# EAGLE design mosfet_shield (EAGLE 7.7.0)
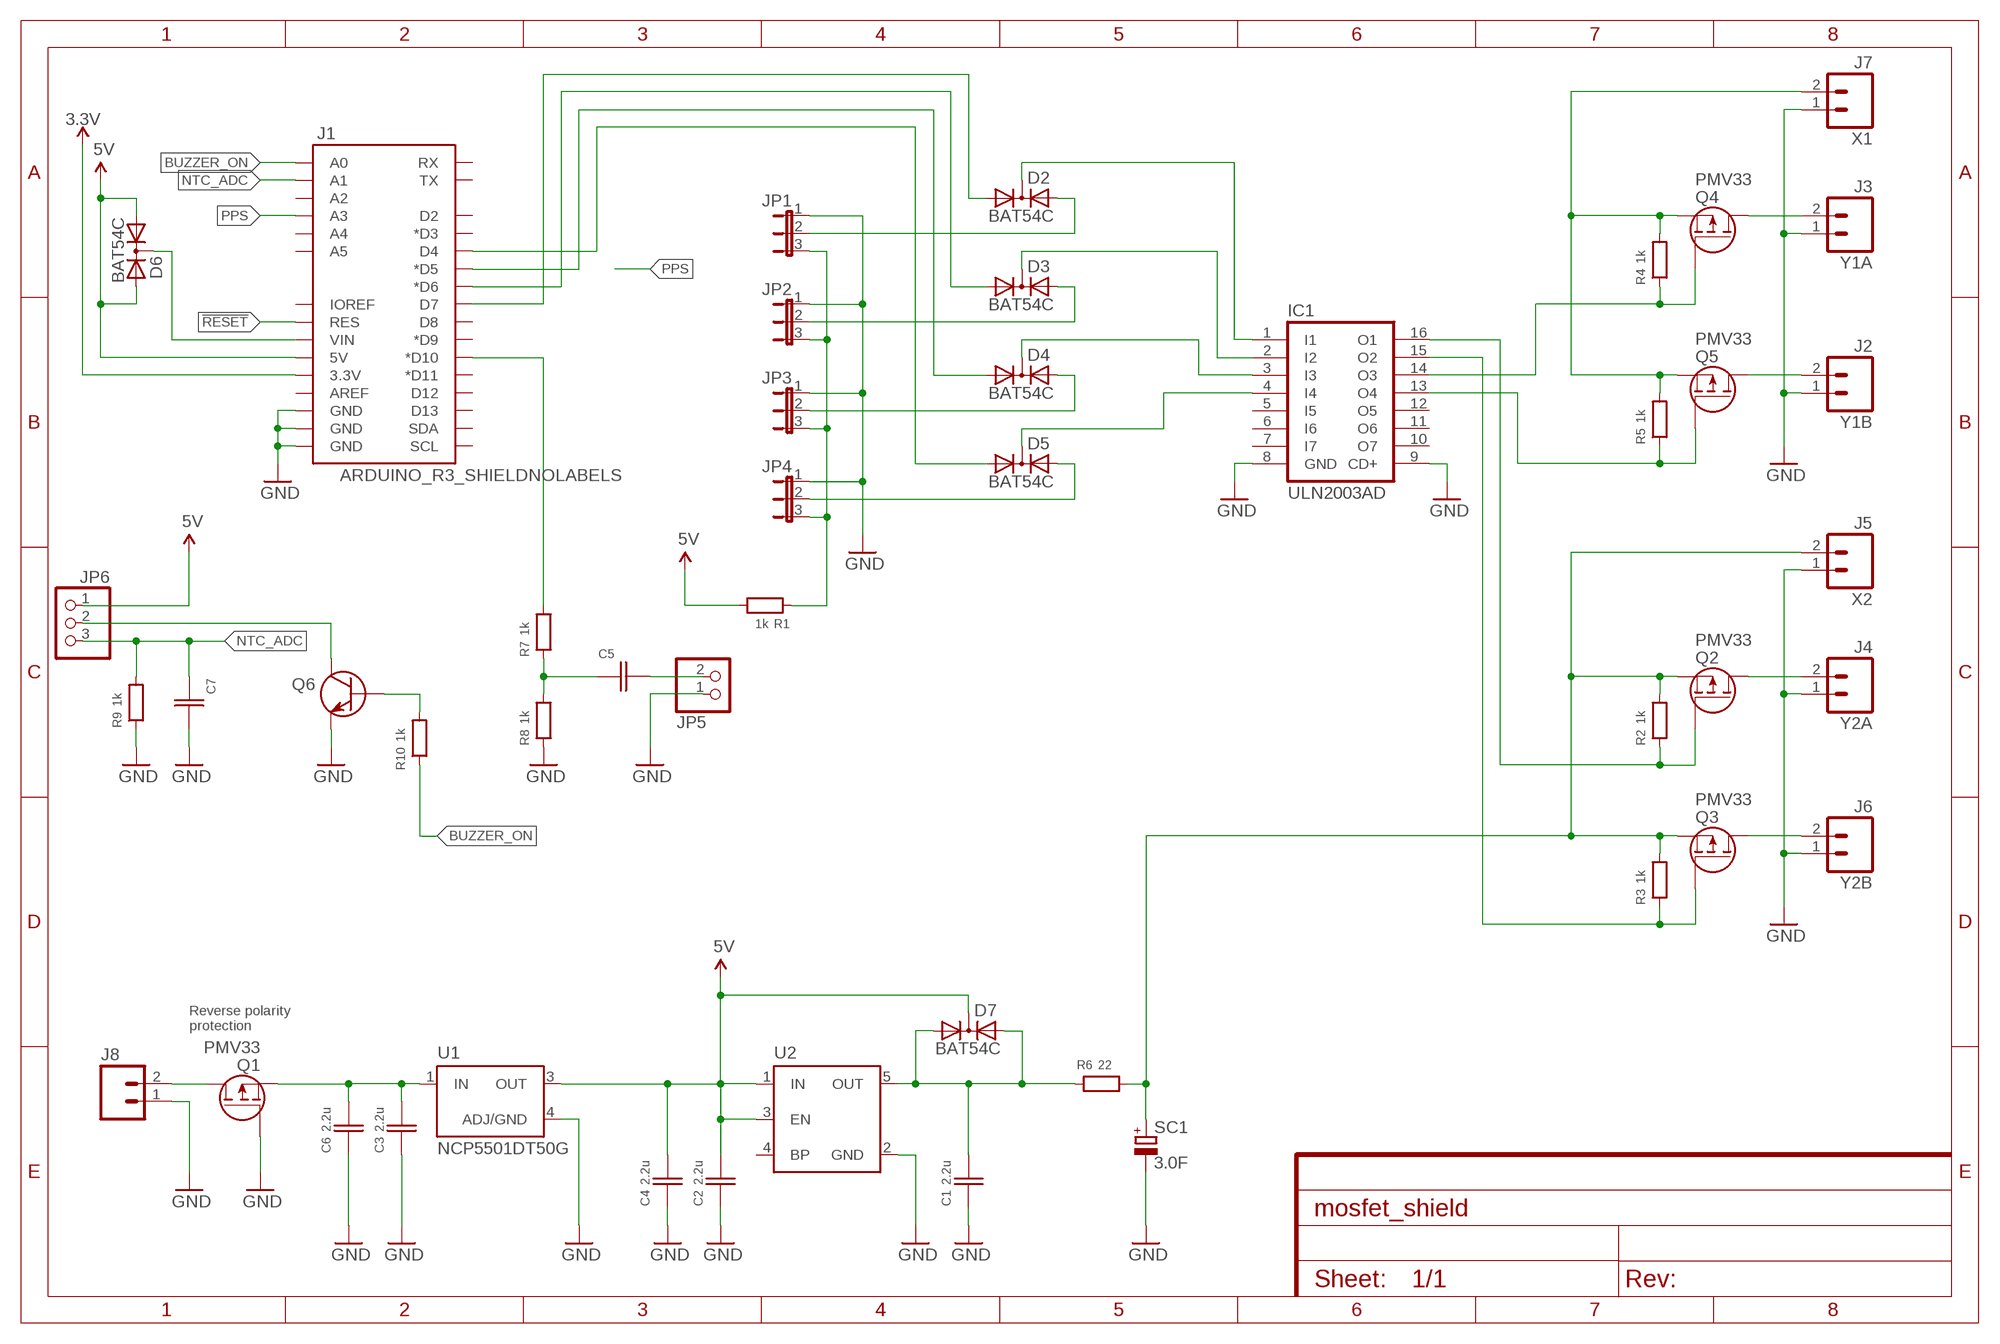
[diagram p0: schematic, sheet 1]

## Parts
C1  2.2u  CAPACITOR_NPOL-1206  [C1206]
C2  2.2u  CAPACITOR_NPOL-1206  [C1206]
C3  2.2u  CAPACITOR_NPOL-1206  [C1206]
C4  2.2u  CAPACITOR_NPOL-1206  [C1206]
C5  CAPACITOR_NPOL-0603  [C603]
C6  2.2u  CAPACITOR_NPOL-1206  [C1206]
C7  CAPACITOR_NPOL-0603  [C603]
D2  BAT54C  DIODE-2AC|CASOT23  [SOT23]
D3  BAT54C  DIODE-2AC|CASOT23  [SOT23]
D4  BAT54C  DIODE-2AC|CASOT23  [SOT23]
D5  BAT54C  DIODE-2AC|CASOT23  [SOT23]
D6  BAT54C  DIODE-2AC|CASOT23  [SOT23]
D7  BAT54C  DIODE-2AC|CASOT23  [SOT23]
IC1  ULN2003AD  [SO16]
J1  ARDUINO_R3_SHIELDNOLABELS  [UNO_R3_SHIELD_NOLABELS]
J2  Y1B  M023.5MM  [SCREWTERMINAL-3.5MM-2]
J3  Y1A  M023.5MM  [SCREWTERMINAL-3.5MM-2]
J4  Y2A  M023.5MM  [SCREWTERMINAL-3.5MM-2]
J5  X2  M023.5MM  [SCREWTERMINAL-3.5MM-2]
J6  Y2B  M023.5MM  [SCREWTERMINAL-3.5MM-2]
J7  X1  M023.5MM  [SCREWTERMINAL-3.5MM-2]
J8  M023.5MM  [SCREWTERMINAL-3.5MM-2]
JP1  JP2E  [JP2]
JP2  JP2E  [JP2]
JP3  JP2E  [JP2]
JP4  JP2E  [JP2]
JP5  PINHD-1X2  [1X02]
JP6  PINHD-1X3  [1X03]
Q1  PMV33  MOSFET-P-SOT23-3  [SOT23-3]
Q2  PMV33  MOSFET-P-SOT23-3  [SOT23-3]
Q3  PMV33  MOSFET-P-SOT23-3  [SOT23-3]
Q4  PMV33  MOSFET-P-SOT23-3  [SOT23-3]
Q5  PMV33  MOSFET-P-SOT23-3  [SOT23-3]
Q6  BJT-NPN-SOT23-3  [SOT23-3]
R1  1k  RESISTOR-0603  [R0603]
R2  1k  RESISTOR-0603  [R0603]
R3  1k  RESISTOR-0603  [R0603]
R4  1k  RESISTOR-0603  [R0603]
R5  1k  RESISTOR-0603  [R0603]
R6  22  RESISTOR-0603  [R0603]
R7  1k  RESISTOR-0603  [R0603]
R8  1k  RESISTOR-0603  [R0603]
R9  1k  RESISTOR-0603  [R0603]
R10  1k  RESISTOR-0603  [R0603]
SC1  3.0F  CPOL-EUE3.5-8  [E3,5-8]
U1  NCP5501DT50G  VREG-3PIN-DPAK  [DPAK]
U2  VREG-5PIN-SOT23  [SOT23-5]

## Nets
3.3V: J1.3.3V
5V: C2.2 C4.2 D6.1(A1) D6.2(A2) D7.3(C) J1.5V JP6.1 R1.2 U1.3(OUT) U2.1(IN) U2.3(EN)
!RESET: J1.RES
BUZZER_ON: J1.A0 R10.1
GND: C1.1 C2.1 C3.1 C4.1 C6.1 C7.2 IC1.8(GND) IC1.9(CD+) J1.GND@0(GND) J1.GND@1(GND) J1.GND@2(GND) J2.1 J3.1 J4.1 J5.1 J6.1 J7.1 J8.1 JP1.1 JP2.1 JP3.1 JP4.1 JP5.1 Q1.1(G) Q6.2(E) R8.1 R9.1 SC1.- U1.4(ADJ/GND) U2.2(GND)
N$1: D2.2(A2) JP1.2
N$2: D3.2(A2) JP2.2
N$3: J3.2 Q4.3(D)
N$4: C3.2 C6.2 Q1.2(S) U1.1(IN)
N$5: IC1.15(O2) Q3.1(G) R3.1
N$6: IC1.16(O1) Q2.1(G) R2.1
N$7: J7.2 Q4.2(S) Q5.2(S) R4.2 R5.2
N$8: J2.2 Q5.3(D)
N$9: J4.2 Q2.3(D)
N$10: J5.2 Q2.2(S) Q3.2(S) R2.2 R3.2 R6.2 SC1.+
N$11: J6.2 Q3.3(D)
N$12: D2.1(A1) J1.D7
N$13: IC1.14(O3) Q4.1(G) R4.1
N$14: IC1.13(O4) Q5.1(G) R5.1
N$15: J1.D10(*D10) R7.2
N$16: C1.2 D7.1(A1) D7.2(A2) R6.1 U2.5(OUT)
N$17: C5.2 JP5.2
N$18: D2.3(C) IC1.1(I1)
N$19: D3.3(C) IC1.2(I2)
N$20: D4.3(C) IC1.3(I3)
N$21: D5.3(C) IC1.4(I4)
N$22: D5.1(A1) J1.D4
N$23: C5.1 R7.1 R8.2
N$24: D6.3(C) J1.VIN
N$25: D4.2(A2) JP3.2
N$26: D5.2(A2) JP4.2
N$29: D4.1(A1) J1.D5(*D5)
N$30: JP6.2 Q6.3(C)
N$31: J8.2 Q1.3(D)
N$34: Q6.1(B) R10.2
N$44: JP1.3 JP2.3 JP3.3 JP4.3 R1.1
N$45: D3.1(A1) J1.D6(*D6)
NTC_ADC: C7.1 J1.A1 JP6.3 R9.2
PPS: J1.A3
Unconnected: IC1.5(I5) IC1.6(I6) IC1.7(I7) IC1.10(O7) IC1.11(O6) IC1.12(O5) J1.A2 J1.A4 J1.A5 J1.AREF J1.D2 J1.D3(*D3) J1.D8 J1.D9(*D9) J1.D11(*D11) J1.D12 J1.D13 J1.IOREF J1.RX J1.SCL J1.SDA J1.TX U2.4(BP)

## Notes on the sheet
- Reverse polarity
  protection

## Library data of the parts
C1-C7 = kg-generic:CAPACITOR_NPOL: Non-Polarized capacitor in various packages
D2-D7 = diode:DIODE-2AC|CA: Dual DIODE Anode-Cathode|Cathode-Anode
IC1 = uln-udn:ULN2003A: DRIVER ARRAY
J1 = SparkFun-Boards:ARDUINO_R3_SHIELD: Shield form compatible with the Arduino Uno R3.
J2-J8 = SparkFun-Connectors:M02: Standard 2-pin 0.1" header. Use with - straight break away headers ( PRT-00116) - right angle break away headers (PRT-00553) - swiss pins (PRT-00743) - machine pins (PRT-00117) - female headers (PRT-00115) Molex polarized connector foot print use with: PRT-08233 with associated crimp pins and housings. 2.54_SCREWTERM for use with PRT-10571. 3.5mm Screw Terminal footprints for PRT-08084 5mm Screw Terminal footprints for use with PRT-08432; PROD_ID: CONN-08399
JP1-JP4 = jumper:JP2E: JUMPER
JP5 = pinhead:PINHD-1X2: PIN HEADER
JP6 = pinhead:PINHD-1X3: PIN HEADER
Q1-Q5 = kg-generic:MOSFET-P: Generic P-MOSFET IRF7406 SO8 30V 5.8A 45mOhm IRLML6401 SOT23-3 12V 4.3A 50mOhm IRLML6402 SOT23-3 20V 3.7A 65mOhm
Q6 = kg-generic:BJT-NPN: Generic NPN BJT BC547 (TO-92 45V 100mA) (1.Collector 2.Base 3.Emitter) 2N3904 (TO-92 40V 200mA) (1.Emitter 2.Base 3.Collector) 2N2222A (TO-92 40V 600mA) (1.Collector 2.Base 3.Emitter)
R1-R10 = kg-generic:RESISTOR: Generic resistor
SC1 = rcl:CPOL-EU: POLARIZED CAPACITOR, European symbol
U1 = kg-generic:VREG-3PIN: Generic 3-pin linear voltage regulator
U2 = kg-generic:VREG-5PIN: Linear voltage regulator with enable pin and a bypass capacitor pin: LP3985

## Board
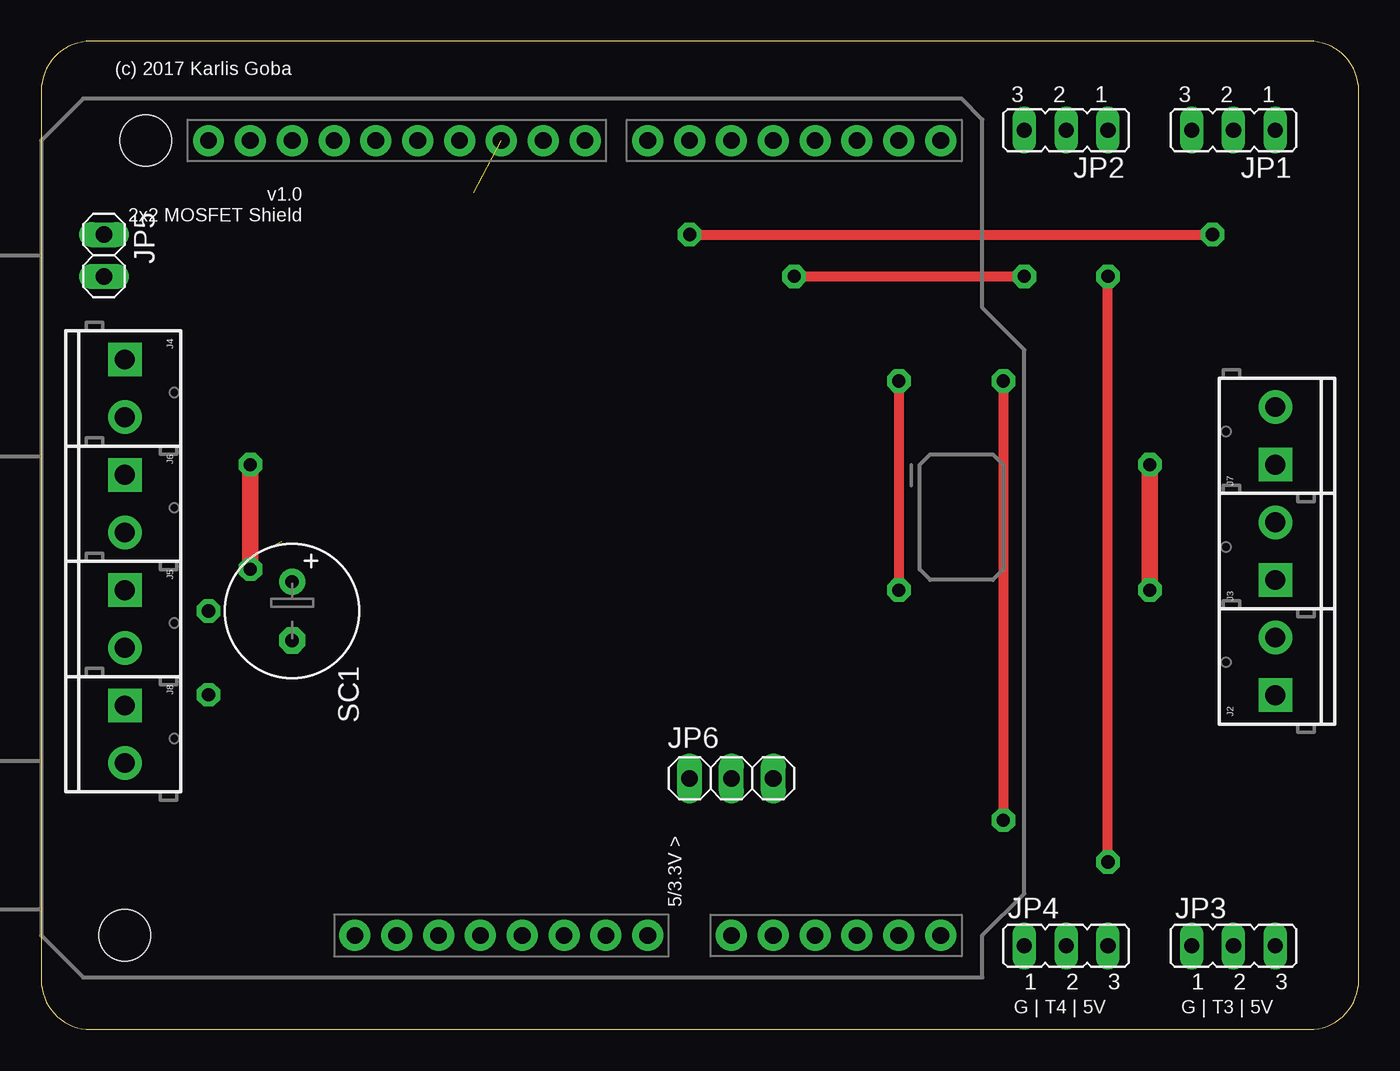
[diagram p1: board, top side]
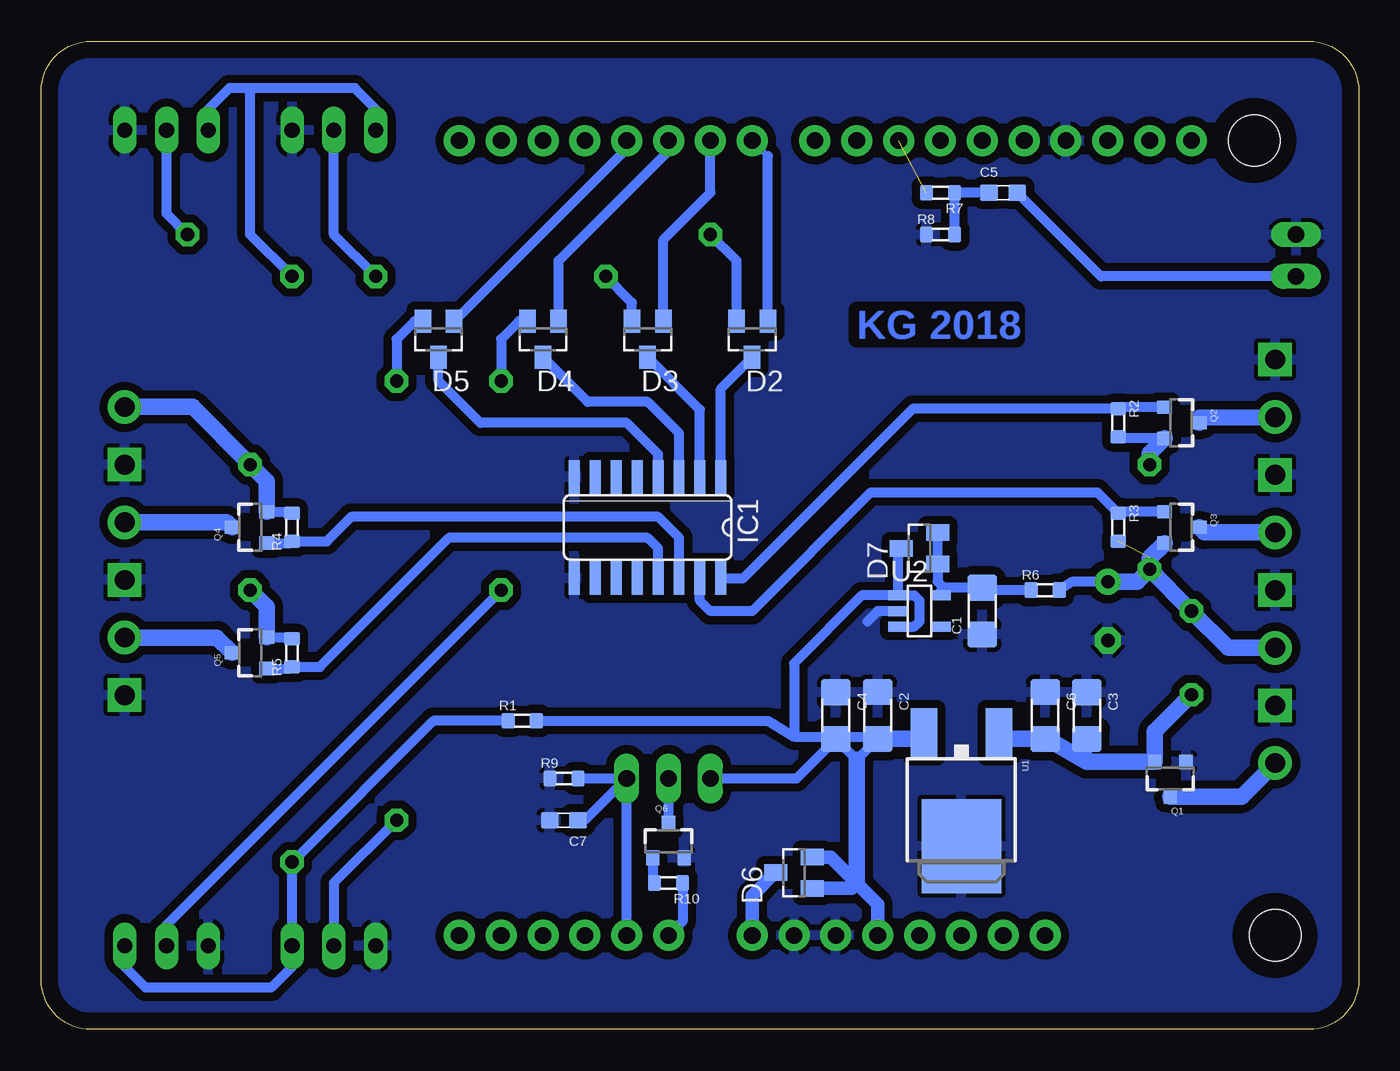
[diagram p2: board, bottom side, seen from below]

Size 80 x 60 mm. Coordinates in mm from the lower left corner, seen from the top.
Outline: 0,57 0,3 arc90 3,0 77,0 arc90 80,3 80,57 arc90 77,60 3,60 arc90 0,57
Copper layers (1*16): Top 0.035mm / dielectric 1.5mm / Bottom 0.035mm
Design rules "default": minimum track width 10mil, minimum drill 24mil, track to track 8mil, track to pad 8mil, pad to pad 8mil, via to via 8mil, smd to smd 8mil, copper to edge 40mil, drill to drill 8mil, minimum pad ring 10mil, minimum via ring 8mil, stop-mask expansion 4mil, vias tented up to drill 0mil, thermal gap 10mil
Holes 3.1 mm at 5.08,5.71 6.35,53.98

### Footprints (pad centres in the part's own frame; a part is rotated, then mirrored left to right if it is on the bottom)
C1206 = smd 1.6 x 1.803: 1 -1.422,0; 2 1.422,0
C603 = smd 1.1 x 1: 1 -0.85,0; 2 0.85,0
SOT23 = smd 1 x 1.4: 1 -0.95,-1.1; 2 0.95,-1.1; 3 0,1.1
SO16 = smd 0.66 x 2.032: 1 -4.445,-3.073; 2 -3.175,-3.073; 3 -1.905,-3.073; 4 -0.635,-3.073; 5 0.635,-3.073; 6 1.905,-3.073; 7 3.175,-3.073; 8 4.445,-3.073; 9 4.445,3.073; 10 3.175,3.073; 11 1.905,3.073; 12 0.635,3.073; 13 -0.635,3.073; 14 -1.905,3.073; 15 -3.175,3.073; 16 -4.445,3.073
UNO_R3_SHIELD_NOLABELS = drill 1.016 pad 1.88: 3.3V 50.8,26.67; 5V 50.8,29.21; A0 50.8,41.91; A1 50.8,44.45; A2 50.8,46.99; A3 50.8,49.53; A4 50.8,52.07; A5 50.8,54.61; AREF 2.54,15.24; D2 2.54,49.53; D3 2.54,46.99; D4 2.54,44.45; D5 2.54,41.91; D6 2.54,39.37; D7 2.54,36.83; D8 2.54,33.02; D9 2.54,30.48; D10 2.54,27.94; D11 2.54,25.4; D12 2.54,22.86; D13 2.54,20.32; GND@0 50.8,31.75; GND@1 50.8,34.29; GND@2 2.54,17.78; IOREF 50.8,21.59; NC 50.8,19.05; RES 50.8,24.13; RX 2.54,54.61; SCL 2.54,10.16; SDA 2.54,12.7; TX 2.54,52.07; VIN 50.8,36.83
SCREWTERMINAL-3.5MM-2 = drill 1.2 pad 2.032 square: 1 0,0 | drill 1.2 pad 2.032: 2 3.5,0
JP2 = drill 0.914 long: 1 -2.54,0; 2 0,0; 3 2.54,0
1X02 = drill 1.016 long: 1 -1.27,0; 2 1.27,0
1X03 = drill 1.016 long: 1 -2.54,0; 2 0,0; 3 2.54,0
SOT23-3 = smd 0.8 x 0.9: 1 -0.95,-1; 2 0.95,-1; 3 0,1.1
R0603 = smd 0.8 x 0.95: 1 -0.85,0; 2 0.85,0
E3,5-8 = drill 0.813 pad 1.6: + -1.778,0 | drill 0.813 pad 1.6 octagon: - 1.778,0
DPAK = smd 1.6 x 3: 1 -2.28,-5.31; 3 2.28,-5.31 | smd 4.826 x 5.715: 4 0,1.588
SOT23-5 = smd 0.6 x 1.2: 1 -0.95,-1.306; 2 0,-1.306; 3 0.95,-1.306; 4 0.95,1.306; 5 -0.95,1.306

### Placement (x,y rotation side)
C1  22.86,25.4 90 bottom
C2  29.21,19.06 270 bottom
C3  16.51,19.05 270 bottom
C4  31.75,19.05 270 bottom
C5  21.59,50.8 0 bottom
C6  19.05,19.06 270 bottom
C7  48.26,12.7 180 bottom
D2  36.83,41.9 180 bottom
D3  43.18,41.9 180 bottom
D4  49.53,41.9 180 bottom
D5  55.88,41.9 180 bottom
D6  34.29,9.52 90 bottom
D7  26.67,29.21 90 bottom
IC1  43.18,30.48 180 bottom
J1  0,56.51 270 top
J2  74.93,20.29 90 top
J3  74.93,27.29 90 top
J4  5.08,40.67 270 top
J5  5.08,26.67 270 top
J6  5.08,33.67 270 top
J7  74.93,34.29 90 top
J8  5.08,19.67 270 top
JP1  72.39,54.6 180 top
JP2  62.23,54.6 180 top
JP3  72.39,5.07 0 top
JP4  62.23,5.07 0 top
JP5  3.81,46.99 270 top
JP6  41.91,15.24 0 top
Q1  11.44,15.24 180 bottom
Q2  10.79,36.83 270 bottom
Q3  10.79,30.48 270 bottom
Q4  67.31,30.48 90 bottom
Q5  67.31,22.86 90 bottom
Q6  41.91,11.43 0 bottom
R1  50.79,18.74 0 bottom
R2  14.61,36.83 270 bottom
R3  14.61,30.48 270 bottom
R4  64.77,30.48 90 bottom
R5  64.77,22.86 90 bottom
R6  19.05,26.67 0 bottom
R7  25.4,50.8 180 bottom
R8  25.4,48.26 0 bottom
R9  48.26,15.24 0 bottom
R10  41.91,8.89 180 bottom
SC1  15.24,25.4 270 top
U1  24.13,12.7 180 bottom
U2  26.67,25.4 270 bottom

### Tracks (layer width: path | path; a pad name or v marks a point on that pad's centre or on a via)
5V
  Bottom 0.406: 26.78,17.64 U1.3 | 29.35,17.78 C2.2
  Bottom 0.61: R1.2 35.87,18.74 34.29,17.78 | 34.29,17.78 29.35,17.78 | C2.2 30.48,16.37 30.49,16.37 C4.2 34.14,15.24 JP6.1 | U2.1 30.16,26.35 34.29,22.23 34.29,17.78 | U2.3 26.98,24.45 26.67,24.77 26.67,26.04 26.98,26.35 U2.1 | U2.1 27.98,29 D7.3
  Bottom 0.813: J1.5V 29.21,7.61 30.48,8.88 | D6.1 30.8,8.56 30.48,8.88 | D6.2 32.06,10.46 30.48,8.88
  Bottom 1.016: C2.2 26.78,17.64 | 30.48,8.88 30.48,16.37
BUZZER_ON
  Bottom 0.61: R10.1 41.06,6.55 J1.A0
GND
  Bottom 0.61: U2.2 29.21,25.4 29.84,24.77
  pour Bottom (isolate 0.5): 82.55,63.3 82.55,-3.17 -2.54,-3.17 -2.54,63.3
N$1  (via drill 0.8 pad 1.42)
  Top 0.61: v39.37,48.26 v71.12,48.26
  Bottom 0.61: D2.2 37.78,46.67 v39.37,48.26 | v71.12,48.26 72.39,49.53 JP1.2
N$2  (via drill 0.8 pad 1.42)
  Top 0.61: v45.72,45.72 v59.69,45.72
  Bottom 0.61: D3.2 44.13,44.13 v45.72,45.72 | v59.69,45.72 62.23,48.26 JP2.2
N$3
  Bottom 1.016: J3.2 68.72,30.79 Q4.3
N$4  (via drill 0.8 pad 1.42)
  Bottom 0.406: 21.48,17.64 U1.1 | 18.68,17.51 19.05,17.78 18.91,17.78 C6.2
  Bottom 0.61: C3.2 16.51,16.24
  Bottom 1.016: C6.2 21.48,17.64 | v10.16,20.32 12.39,18.09 Q1.2 16.51,16.24 18.68,17.51
N$5
  Bottom 0.61: Q3.1 14.61,31.43 R3.1 15.88,32.6 29.63,32.6 36.83,25.4 39.37,25.4 40.01,26.04 IC1.15
N$6
  Bottom 0.406: 14.61,37.78 R2.1
  Bottom 0.61: Q2.1 14.61,37.78 | R2.1 27.09,37.68 37.36,27.41 IC1.16
N$7  (via drill 0.8 pad 1.42)
  Top 1.016: v67.31,34.29 v67.31,26.67
  Bottom 0.406: 64.87,23.81 R5.2 | 64.87,31.43 R4.2
  Bottom 0.61: Q5.2 64.87,23.81 | Q4.2 64.87,31.43
  Bottom 1.016: Q4.2 66.31,33.29 v67.31,34.29 70.81,37.79 J7.2 | Q5.2 66.31,25.67 v67.31,26.67
N$8
  Bottom 1.016: J2.2 69.34,23.79 Q5.3
N$9
  Bottom 1.016: J4.2 9.7,37.14 Q2.3
N$10  (via drill 0.8 pad 1.42)  (1 unrouted)
  Top 1.016: v12.7,27.94 v12.7,34.29
  Bottom 0.406: 14.61,35.88 R2.2 14.82,35.98
  Bottom 0.61: Q2.2 14.61,35.88 | SC1.+ 17.44,27.18 R6.2
  Bottom 1.016: J5.2 7.93,23.17 v10.16,25.4 v12.7,27.94 | v12.7,27.94 13.46,27.18 SC1.+ | v12.7,34.29 12.7,34.98 Q2.2 | v12.7,27.94 12.7,28.62 Q3.2
N$11
  Bottom 1.016: J6.2 9.38,30.17 Q3.3
N$12
  Bottom 0.406: 35.88,53.02 J1.D7
  Bottom 0.61: D2.1 35.88,53.02
N$13
  Bottom 0.406: 64.87,29.53 R4.1
  Bottom 0.61: IC1.14 41.27,29.84 42.55,31.11 61.17,31.11 62.66,29.63 R4.1 | Q4.1 64.87,29.53
N$14
  Bottom 0.406: 64.87,21.91 R5.1
  Bottom 0.61: IC1.13 42.55,29.21 43.18,29.84 55.24,29.84 63.08,22.01 R5.1 | Q5.1 64.87,21.91
N$15  (1 unrouted)
N$16
  Bottom 0.406: 22.71,26.67 C1.2
  Bottom 0.61: C1.2 25.2,26.82 | R6.1 22.71,26.67 | D7.2 D7.1 25.57,27.19 25.2,26.82 | U2.5 25.36,26.66 25.2,26.82
N$17
  Bottom 0.61: JP5.2 15.66,45.72 C5.2
N$18
  Bottom 0.61: IC1.1 38.73,38.9 D2.3
N$19
  Bottom 0.61: IC1.2 40.01,37.62 D3.3
N$20
  Bottom 0.61: IC1.3 41.27,36.2 43.18,38.1 46.83,38.1 D4.3
N$21
  Bottom 0.61: IC1.4 42.55,34.92 44.45,36.83 53.34,36.83 55.88,39.37 D5.3
N$22
  Bottom 0.61: J1.D4 44.45,53.48 D5.1
N$23
  Bottom 0.61: C5.1 R7.1 R8.2
N$24
  Bottom 0.813: J1.VIN 36.83,8.12 35.39,9.56 D6.3
N$25  (via drill 0.8 pad 1.42)
  Top 0.61: v52.07,39.37 v52.07,26.67
  Bottom 0.61: D4.2 50.98,43 52.07,41.91 v52.07,39.37 | v52.07,26.67 72.39,6.35 JP3.2
N$26  (via drill 0.8 pad 1.42)
  Top 0.61: v58.42,39.37 v58.42,12.7
  Bottom 0.61: D5.2 57.33,43 58.42,41.91 v58.42,39.37 | v58.42,12.7 62.23,8.89 JP4.2
N$29
  Bottom 0.61: J1.D5 41.91,53.34 48.58,46.67 D4.1
N$30
  Bottom 0.61: Q6.3 JP6.2
N$31
  Bottom 1.016: Q1.3 7.11,14.14 J8.2
N$34
  Bottom 0.61: Q6.1 42.86,8.99 R10.2
N$44  (via drill 0.8 pad 1.42)
  Top 0.61: v64.77,10.16 v64.77,45.72
  Bottom 0.61: JP2.3 59.69,55.88 60.96,57.15 67.31,57.15 | 67.31,57.15 68.58,57.15 69.85,55.88 JP1.3 | JP3.3 74.93,3.81 73.66,2.54 66.04,2.54 64.77,3.81 JP4.3 v64.77,10.16 56.19,18.74 R1.1 | v64.77,45.72 67.31,48.26 67.31,57.15
N$45
  Bottom 0.61: D3.1 42.23,47.94 39.37,50.8 J1.D6
NTC_ADC
  Bottom 0.61: J1.A1 JP6.3 | R9.2 JP6.3 | C7.1 46.99,12.7 JP6.3

### Text on the board
Bottom: KG 2018
tPlace: (c) 2017 Karlis Goba | v1.0 | 2x2 MOSFET Shield | 5/3.3V > | G | T4 | 5V | G | T3 | 5V